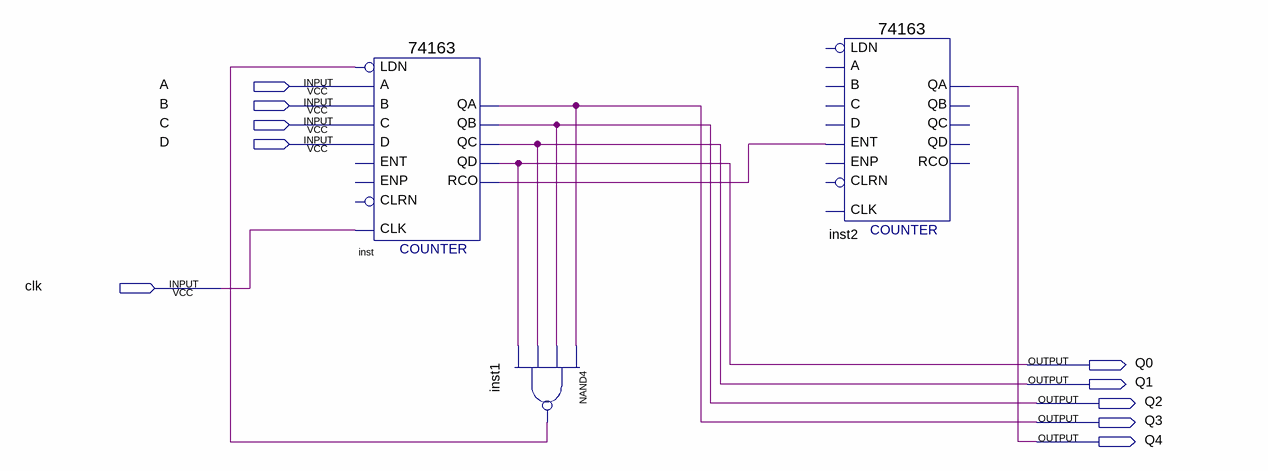
[diagram p0: schematic sheet]
// Quartus schematic COUNT3.bdf as structural Verilog: 3 symbols, 10 pins
module COUNT3 (
  input  A,
  input  B,
  input  C,
  input  D,
  input  clk,
  output Q0,
  output Q1,
  output Q2,
  output Q3,
  output Q4
);

  wire inst1_out, inst_rco;

  \74163  inst (
    .C(C), .B(B), .A(A), .D(D), .CLK(clk), .LDN(inst1_out), .QA(Q3), .QB(Q2), .QC(Q1), .QD(Q0), .RCO(inst_rco));  // open: ENT, CLRN, ENP
  nand inst1 (inst1_out, Q3, Q2, Q1, Q0);
  \74163  inst2 (.ENT(inst_rco), .QA(Q4));  // open: C, B, A, D, CLRN, CLK, ENP, LDN, QB, QC, QD, RCO
endmodule
